# Altium project PCB_Project1.PrjPCB
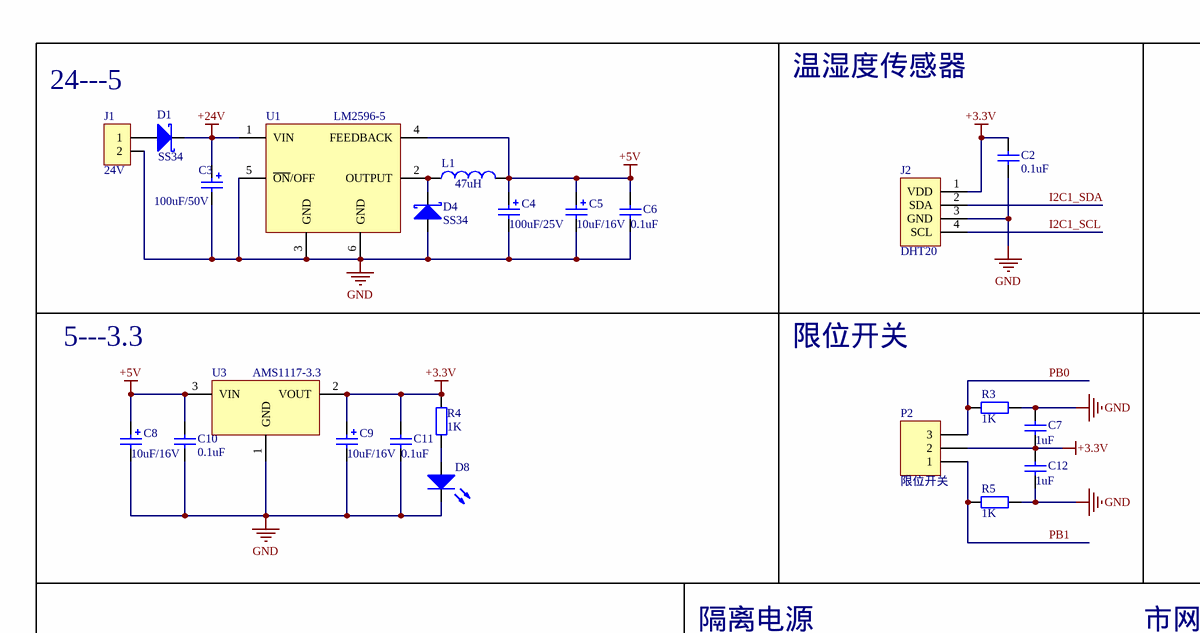
[diagram p0: Sheet1.SchDoc, top left]
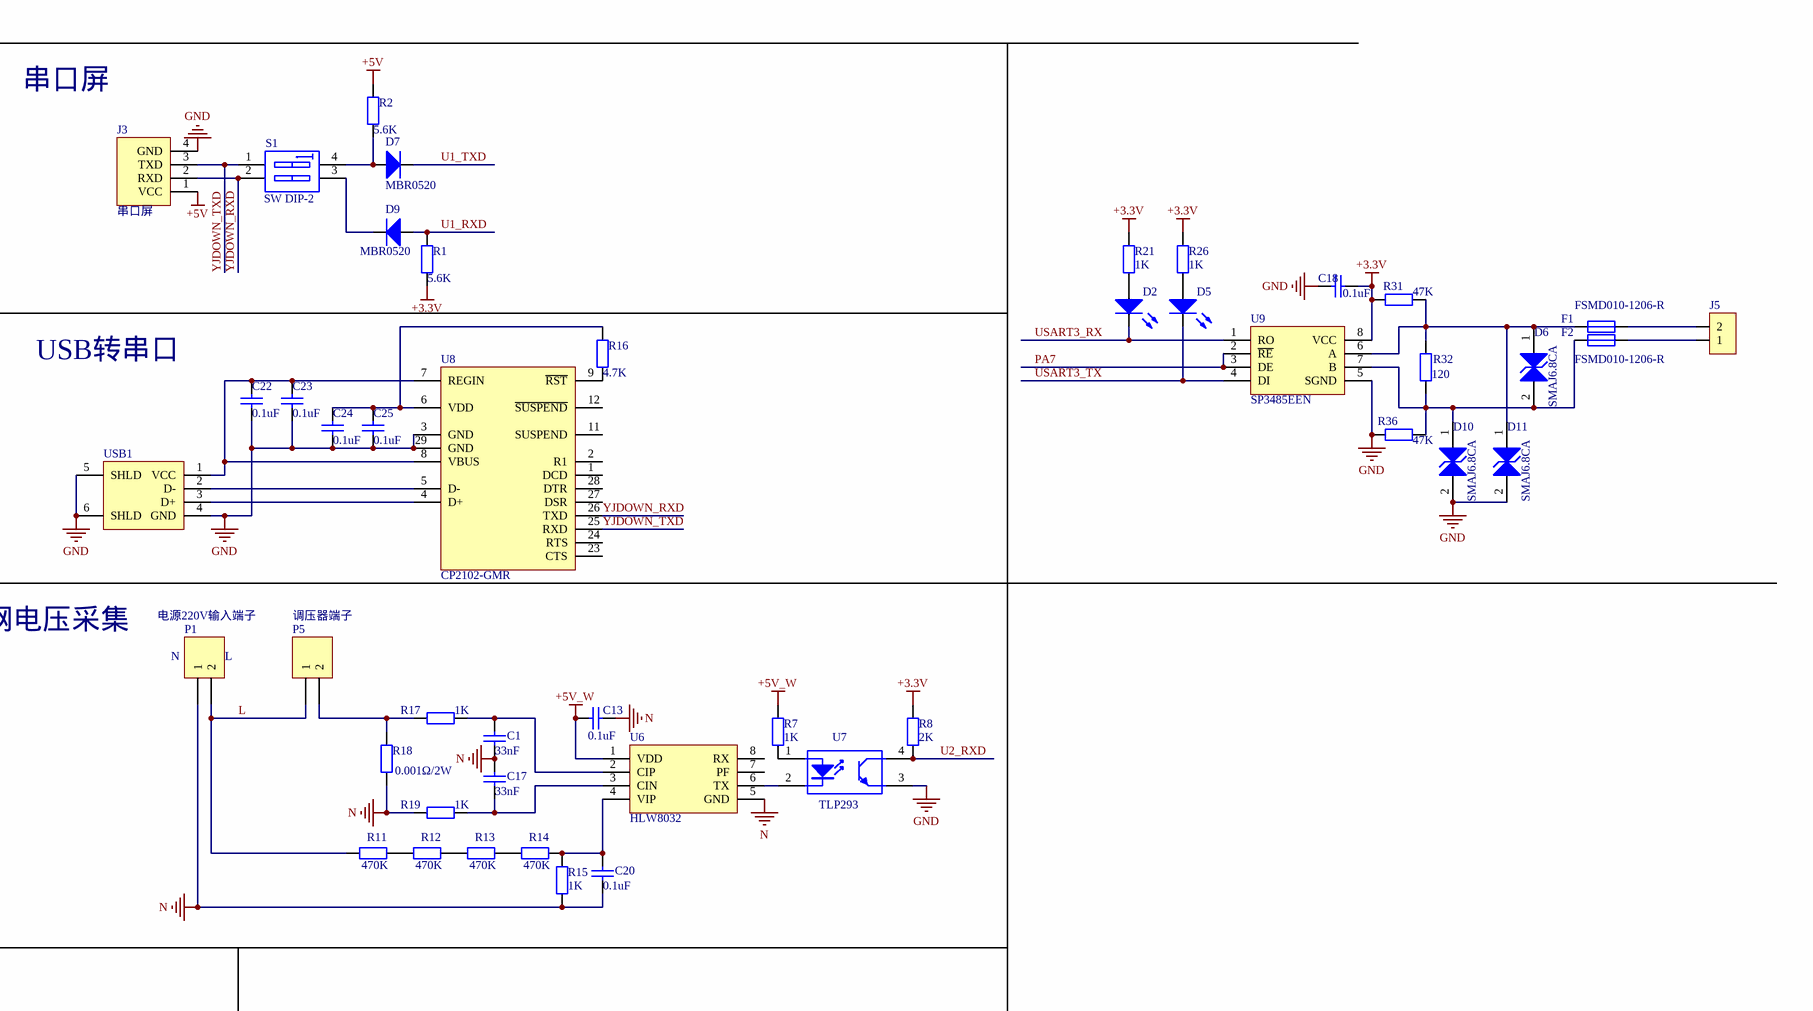
[diagram p1: Sheet1.SchDoc, top right]
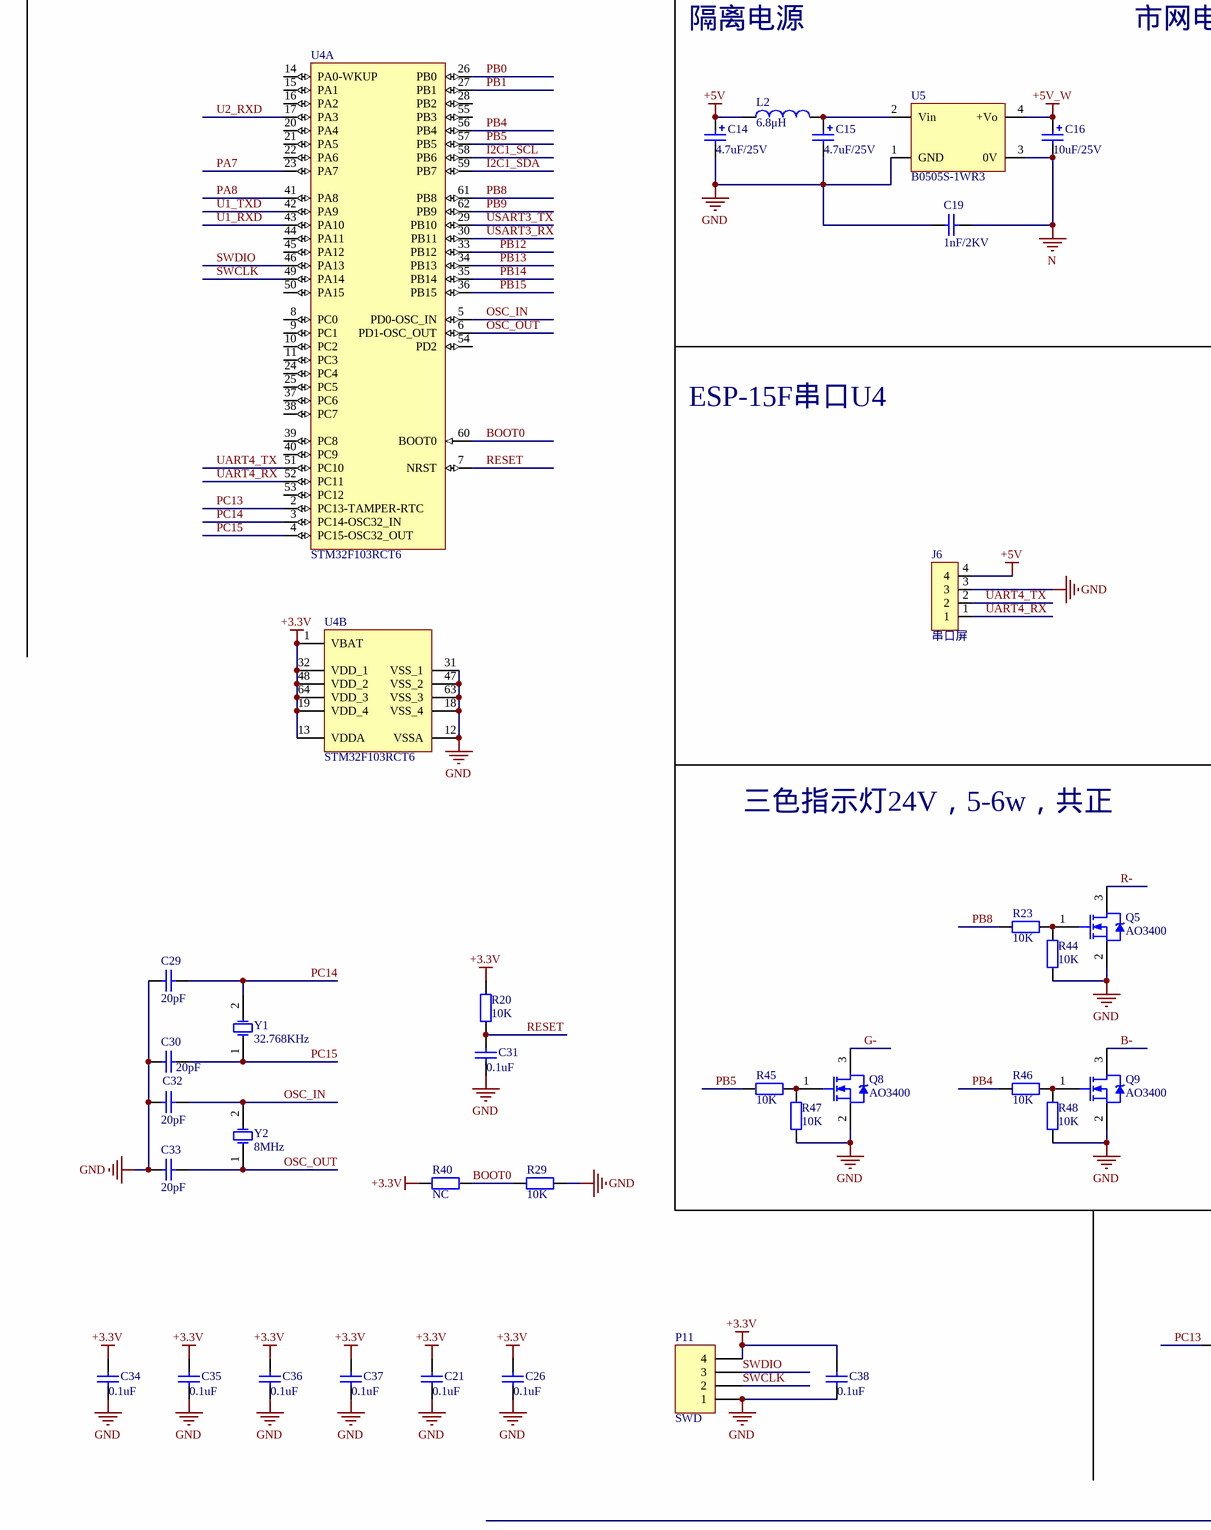
[diagram p2: Sheet1.SchDoc, bottom left]
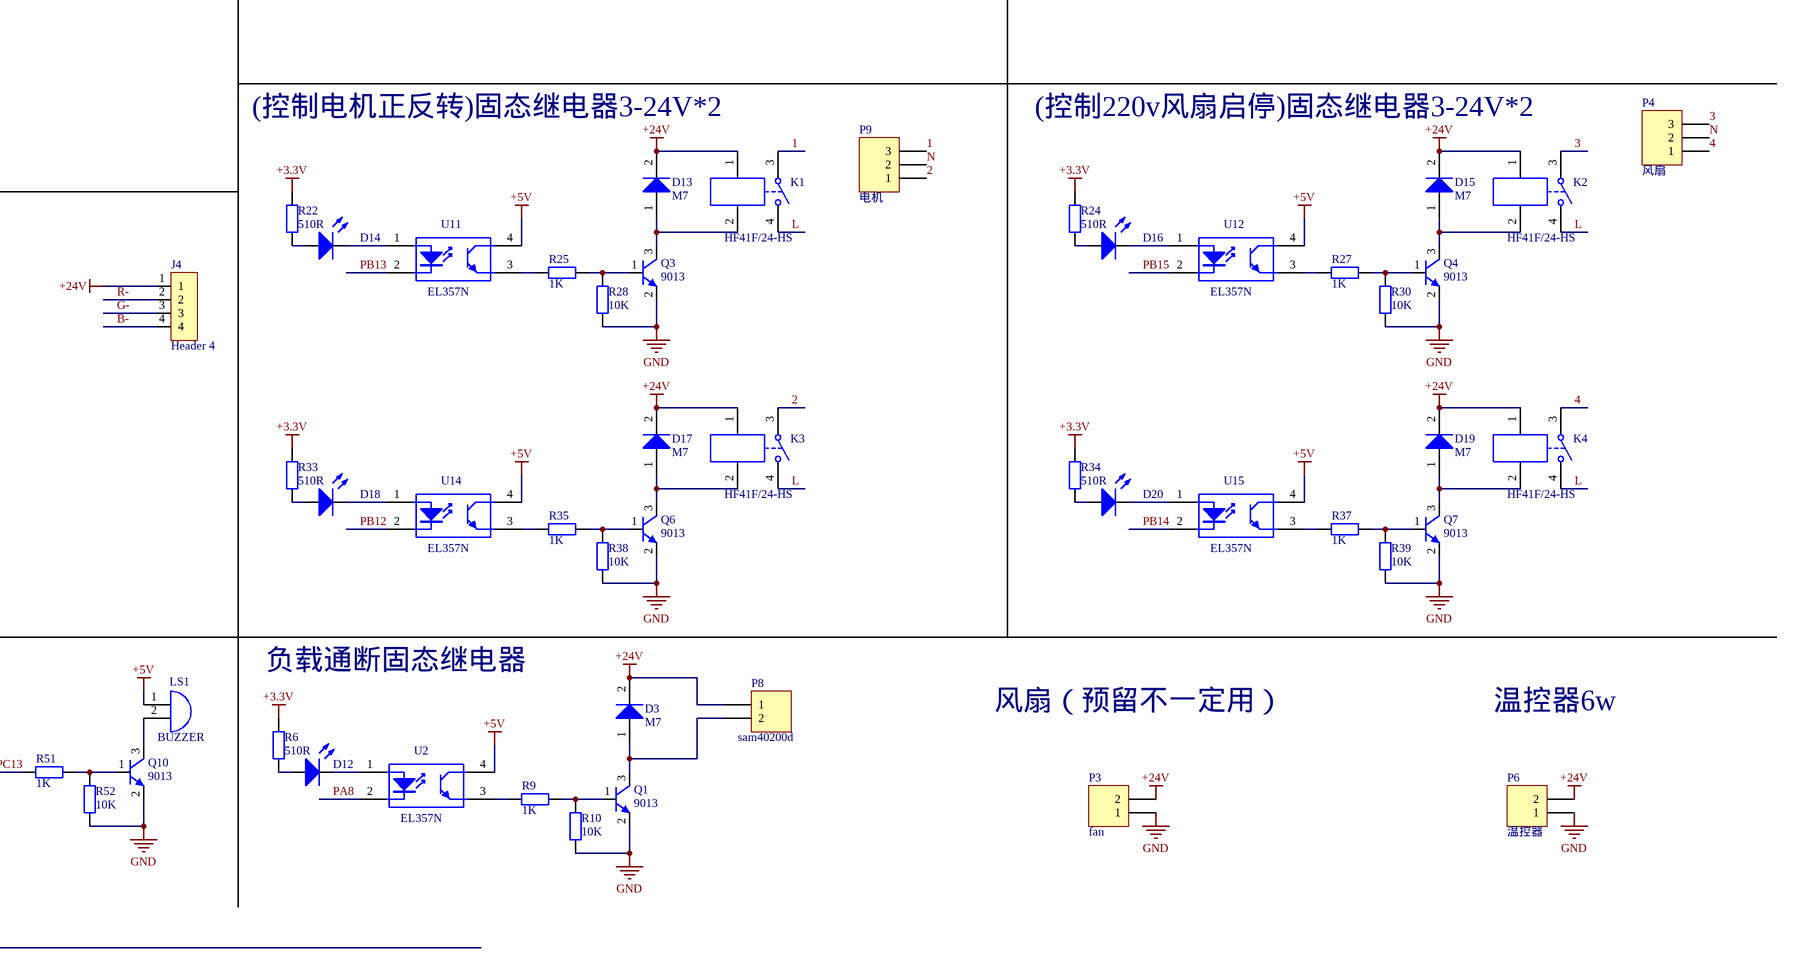
[diagram p3: Sheet1.SchDoc, bottom right]
1 sheet, 153 parts. Net scope: global (net labels, ports and power ports of the same name join across sheets).
Board file: PCB1.PcbDoc

## Sheet Sheet1.SchDoc
size A2; SheetNumber: 0; SheetTotal: 0

### Parts
C1  33nF  [1206_C]
C2  0.1uF  [0603_C]
C3  100uF/50V  [CM F(8*10.2)]
C4  100uF/25V  [CM D8(6.3*7.7)]
C5  10uF/16V  [CASE-A_3216]
C6  0.1uF  [0603_C]
C7  1uF  [0603_C]
C8  10uF/16V  [CASE-A_3216]
C9  10uF/16V  [CASE-A_3216]
C10  0.1uF  [0603_C]
C11  0.1uF  [0603_C]
C12  1uF  [0603_C]
C13  0.1uF  [0603_C]
C14  4.7uF/25V  [CASE-A_3216]
C15  4.7uF/25V  [CASE-A_3216]
C16  10uF/25V  [CASE-A_3216]
C17  33nF  [1206_C]
C18  0.1uF  [0603_C]
C19  1nF/2KV  [MLCC5.08-A]
C20  0.1uF  [1206_C]
C21  0.1uF  [0603_C]
C22  0.1uF  [0603_C]
C23  0.1uF  [0603_C]
C24  0.1uF  [0603_C]
C25  0.1uF  [0603_C]
C26  0.1uF  [0603_C]
C29  20pF  [0603_C]
C30  20pF  [0603_C]
C31  0.1uF  [0603_C]
C32  20pF  [0603_C]
C33  20pF  [0603_C]
C34  0.1uF  [0603_C]
C35  0.1uF  [0603_C]
C36  0.1uF  [0603_C]
C37  0.1uF  [0603_C]
C38  0.1uF  [0603_C]
D1  SS34  [SMA(DO-214AC)]
D2  LED  [LED 0603R]  (value not drawn)
D3  M7  [SMA(DO-214AC)]
D4  SS34  [SMA(DO-214AC)]
D5  LED  [LED 0603R]  (value not drawn)
D6  SMAJ6.8CA  [SMA-BIB]
D7  MBR0520  [SOD-123]
D8  LED  [LED 0603R]  (value not drawn)
D9  MBR0520  [SOD-123]
D10  SMAJ6.8CA  [SMA-BIB]
D11  SMAJ6.8CA  [SMA-BIB]
D12  LED  [LED 0603R]  (value not drawn)
D13  M7  [SMA(DO-214AC)]
D14  LED  [LED 0603R]  (value not drawn)
D15  M7  [SMA(DO-214AC)]
D16  LED  [LED 0603R]  (value not drawn)
D17  M7  [SMA(DO-214AC)]
D18  LED  [LED 0603R]  (value not drawn)
D19  M7  [SMA(DO-214AC)]
D20  LED  [LED 0603R]  (value not drawn)
F1  FSMD010-1206-R  [1206_L]
F2  FSMD010-1206-R  [1206_L]
J1  24V  [KF2EDGK5.08-LI-2P]
J2  DHT20  [HDR2.54-LI-4P]
J3  串口屏  [XH2.54-LI-4P]
J4  Header 4  [XH2.54-LI-4P]
J5  (no value)  [XH2.54-LI-2P]
J6  串口屏  [XH2.54-LI-4P]
K1  HF41F/24-HS  [RELAY-TH_HF41F-XX-HS]
K2  HF41F/24-HS  [RELAY-TH_HF41F-XX-HS]
K3  HF41F/24-HS  [RELAY-TH_HF41F-XX-HS]
K4  HF41F/24-HS  [RELAY-TH_HF41F-XX-HS]
L1  47uH  [CDRH127]
L2  6.8μH  [IND-SMD_L4.4-W4.2]
LS1  BUZZER  [BEEP 7.6x12x9.5]
P1  电源220V输入端子  [CONN-TH_KF8500-8.5-2P]
P2  限位开关  [XH2.54-LI-3P]
P3  fan  [XH2.54-LI-2P]
P4  风扇  [CONN-TH_KF8500-8.5-3P]
P5  调压器端子  [CONN-TH_KF8500-8.5-2P]
P6  温控器  [XH2.54-LI-2P]
P8  sam40200d  [XH2.54-LI-2P]
P9  电机  [CONN-TH_KF8500-8.5-3P]
P11  SWD  [HDR2.54-LI-4P]
Q1  9013  [SOT-23(SOT-23-3)]
Q3  9013  [SOT-23(SOT-23-3)]
Q4  9013  [SOT-23(SOT-23-3)]
Q5  AO3400  [SOT-23(SOT-23-3)]
Q6  9013  [SOT-23(SOT-23-3)]
Q7  9013  [SOT-23(SOT-23-3)]
Q8  AO3400  [SOT-23(SOT-23-3)]
Q9  AO3400  [SOT-23(SOT-23-3)]
Q10  9013  [SOT-23(SOT-23-3)]
R1  5.6K  [0603_R]
R2  5.6K  [0603_R]
R3  1K  [0603_R]
R4  1K  [0603_R]
R5  1K  [0603_R]
R6  510R  [0603_R]
R7  1K  [0603_R]
R8  2K  [0603_R]
R9  1K  [0603_R]
R10  10K  [0603_R]
R11  470K  [1206_R]
R12  470K  [1206_R]
R13  470K  [1206_R]
R14  470K  [1206_R]
R15  1K  [1206_R]
R16  4.7K  [0603_R]
R17  1K  [1206_R]
R18  0.001Ω/2W  [2512_R]
R19  1K  [1206_R]
R20  10K  [0603_R]
R21  1K  [0603_R]
R22  510R  [0603_R]
R23  10K  [0603_R]
R24  510R  [0603_R]
R25  1K  [0603_R]
R26  1K  [0603_R]
R27  1K  [0603_R]
R28  10K  [0603_R]
R29  10K  [0603_R]
R30  10K  [0603_R]
R31  47K  [0603_R]
R32  120  [0603_R]
R33  510R  [0603_R]
R34  510R  [0603_R]
R35  1K  [0603_R]
R36  47K  [0603_R]
R37  1K  [0603_R]
R38  10K  [0603_R]
R39  10K  [0603_R]
R40  NC  [0603_R]
R44  10K  [0603_R]
R45  10K  [0603_R]
R46  10K  [0603_R]
R47  10K  [0603_R]
R48  10K  [0603_R]
R51  1K  [0603_R]
R52  10K  [0603_R]
S1  SW DIP-2  [CSW DIP-2P]
U1  LM2596-5  [TO-263-5]
U2  EL357N  [SMD-4]
U3  AMS1117-3.3  [SOT-223]
U4  STM32F103RCT6  [LQFP64 10x10_N]  (parts A,B of 2)
U5  B0505S-1WR3  [PWRM-TH_B0503S-1WR2]
U6  HLW8032  [SOP-8_150mil]
U7  TLP293  [SMD-4]
U8  CP2102-GMR  [QFN-28_5x5x05P]
U9  SP3485EEN  [SOIC-8_150mil]
U11  EL357N  [SMD-4]
U12  EL357N  [SMD-4]
U14  EL357N  [SMD-4]
U15  EL357N  [SMD-4]
USB1  (no value)  [USB2.0-A]
Y1  32.768KHz  [OSC-3x8-LI]
Y2  8MHz  [OSC HC-49S]

### Nets
+3.3V: C2.2 C7.1 C9.1 C11.2 C12.2 C18.1 C21.2 C26.2 C34.2 C35.2 C36.2 C37.2 C38.2 J2.1(VDD) P2.2 P11.4 R1.2 R4.2 R6.1 R8.2 R20.2 R21.2 R22.1 R24.1 R26.2 R31.2 R33.1 R34.1 R40.2 U3.2(VOUT) U4.1(VBAT) U4.13(VDDA) U4.19(VDD_4) U4.32(VDD_1) U4.48(VDD_2) U4.64(VDD_3) U9.8(VCC)
+5V: C4.1 C5.1 C6.2 C8.1 C10.2 C14.1 J3.1(VCC) J6.4 L1.2 L2.1 LS1.1 R2.1 U1.4(FEEDBACK) U2.4 U3.3(VIN) U11.4 U12.4 U14.4 U15.4
+5V_W: C13.2 C16.1 R7.2 U5.4(+Vo) U6.1(VDD)
+24V: C3.1 D1.2 D3.2(K) D13.2(K) D15.2(K) D17.2(K) D19.2(K) J4.1 K1.1 K2.1 K3.1 K4.1 P3.2 P6.2 P8.1 U1.1(VIN)
GND: C2.1 C3.2 C4.2 C5.2 C6.1 C7.2 C8.2 C9.2 C10.1 C11.1 C12.1 C14.2 C15.2 C18.2 C19.1 C21.1 C22.1 C23.1 C24.1 C25.1 C26.1 C29.2 C30.2 C31.1 C32.2 C33.2 C34.1 C35.1 C36.1 C37.1 C38.1 D4.1 D8.2 D10.2(K) D11.2(K) J1.2 J2.3(GND) J3.4(GND) J6.3 P3.1 P6.1 P11.1 Q1.2 Q3.2 Q4.2 Q5.2(S) Q6.2 Q7.2 Q8.2(S) Q9.2(S) Q10.2 R3.1 R5.1 R10.1 R28.1 R29.2 R30.1 R36.2 R38.1 R39.1 R44.1 R47.1 R48.1 R52.1 U1.3(GND) U1.5(~{ON}/OFF) U1.6(GND) U3.1(GND) U4.12(VSSA) U4.18(VSS_4) U4.31(VSS_1) U4.47(VSS_2) U4.63(VSS_3) U5.1(GND) U7.3 U8.3(GND) U8.29(GND) U9.5(SGND) USB1.4(GND) USB1.5(SHLD) USB1.6(SHLD)
N: C1.1 C13.1 C16.2 C17.2 C19.2 C20.1 P1.1 P4.2 P9.2 R15.2 R18.2 R19.2 U5.3(0V) U6.5(GND)
1: K1.3 P9.3
2: K3.3 P9.1
3: K2.3 P4.3
4: K4.3 P4.1
B-: J4.4 Q9.3(D)
BOOT0: R29.1 R40.1 U4.60(BOOT0)
G-: J4.3 Q8.3(D)
I2C1_SCL: J2.4(SCL) U4.58(PB6)
I2C1_SDA: J2.2(SDA) U4.59(PB7)
L: K1.4 K2.4 K3.4 K4.4 P1.2 P5.1 R11.2
OSC_IN: C32.1 U4.5(PD0-OSC_IN) Y2.2(OSC2)
OSC_OUT: C33.1 U4.6(PD1-OSC_OUT) Y2.1(OSC1)
PA7: U4.23(PA7) U9.2(~{RE}) U9.3(DE)
PA8: U2.2 U4.41(PA8)
PB0: P2.3 R3.2 U4.26(PB0)
PB1: P2.1 R5.2 U4.27(PB1)
PB4: R46.2 U4.56(PB4)
PB5: R45.2 U4.57(PB5)
PB8: R23.2 U4.61(PB8)
PB9: U4.62(PB9)
PB12: U4.33(PB12) U14.2
PB13: U4.34(PB13) U11.2
PB14: U4.35(PB14) U15.2
PB15: U4.36(PB15) U12.2
PC13: R51.2 U4.2(PC13-TAMPER-RTC)
PC14: C29.1 U4.3(PC14-OSC32_IN) Y1.2(OSC2)
PC15: C30.1 U4.4(PC15-OSC32_OUT) Y1.1(OSC1)
R-: J4.2 Q5.3(D)
RESET: C31.2 R20.1 U4.7(NRST)
SWCLK: P11.2 U4.49(PA14)
SWDIO: P11.3 U4.46(PA13)
U1_RXD: D9.1(A) R1.1 U4.43(PA10)
U1_TXD: D7.2(K) U4.42(PA9)
U2_RXD: R8.1 U4.17(PA3) U7.4
UART4_RX: J6.1 U4.52(PC11)
UART4_TX: J6.2 U4.51(PC10)
USART3_RX: D2.2 U4.30(PB11) U9.1(RO)
USART3_TX: D5.2 U4.29(PB10) U9.4(DI)
YJDOWN_RXD: J3.2(RXD) S1.2(A2) U8.26(TXD)
YJDOWN_TXD: J3.3(TXD) S1.1(A1) U8.25(RXD)
NetC1_2: C1.2 R17.1 U6.2(CIP)
NetC15_1: C15.1 L2.2 U5.2(Vin)
NetC17_1: C17.1 R19.1 U6.3(CIN)
NetC20_2: C20.2 R14.1 R15.1 U6.4(VIP)
NetC22_2: C22.2 C23.2 U8.7(REGIN) U8.8(VBUS) USB1.1(VCC)
NetC24_2: C24.2 C25.2 R16.2 U8.6(VDD)
NetD1_1: D1.1 J1.1
NetD2_1: D2.1 R21.1
NetD3_1: D3.1(A) P8.2 Q1.3
NetD4_2: D4.2 L1.1 U1.2(OUTPUT)
NetD5_1: D5.1 R26.1
NetD6_1: D6.1(A) D11.1(A) F1.1 R31.1 R32.2 U9.6(A)
NetD6_2: D6.2(K) D10.1(A) F2.1 R32.1 R36.1 U9.7(B)
NetD7_1: D7.1(A) R2.2 S1.4(B1)
NetD8_1: D8.1 R4.1
NetD9_2: D9.2(K) S1.3(B2)
NetD12_1: D12.1 R6.2
NetD12_2: D12.2 U2.1
NetD13_1: D13.1(A) K1.2 Q3.3
NetD14_1: D14.1 R22.2
NetD14_2: D14.2 U11.1
NetD15_1: D15.1(A) K2.2 Q4.3
NetD16_1: D16.1 R24.2
NetD16_2: D16.2 U12.1
NetD17_1: D17.1(A) K3.2 Q6.3
NetD18_1: D18.1 R33.2
NetD18_2: D18.2 U14.1
NetD19_1: D19.1(A) K4.2 Q7.3
NetD20_1: D20.1 R34.2
NetD20_2: D20.2 U15.1
NetF1_2: F1.2 J5.2
NetF2_2: F2.2 J5.1
NetLS1_2: LS1.2 Q10.3
NetP5_2: P5.2 R17.2 R18.1
NetQ1_1: Q1.1 R9.1 R10.2
NetQ3_1: Q3.1 R25.1 R28.2
NetQ4_1: Q4.1 R27.1 R30.2
NetQ5_1: Q5.1(G) R23.1 R44.2
NetQ6_1: Q6.1 R35.1 R38.2
NetQ7_1: Q7.1 R37.1 R39.2
NetQ8_1: Q8.1(G) R45.1 R47.2
NetQ9_1: Q9.1(G) R46.1 R48.2
NetQ10_1: Q10.1 R51.1 R52.2
NetR7_1: R7.1 U7.1
NetR9_2: R9.2 U2.3
NetR11_1: R11.1 R12.2
NetR12_1: R12.1 R13.2
NetR13_1: R13.1 R14.2
NetR16_1: R16.1 U8.9(~{RST})
NetR25_2: R25.2 U11.3
NetR27_2: R27.2 U12.3
NetR35_2: R35.2 U14.3
NetR37_2: R37.2 U15.3
NetU6_6: U6.6(TX) U7.2
NetU8_4: U8.4(D+) USB1.3(D+)
NetU8_5: U8.5(D-) USB1.2(D-)

Not connected (* = marked no-connect by the designer): U4 8(PC0) 9(PC1) 10(PC2) 11(PC3) 14(PA0-WKUP) 15(PA1) 16(PA2) 20(PA4) 21(PA5) 22(PA6) 24(PC4) 25(PC5) 28(PB2) 37(PC6) 38(PC7) 39(PC8) 40(PC9) 44(PA11) 45(PA12) 50(PA15) 53(PC12) 54(PD2) 55(PB3); U6 7(PF) 8(RX); U8 1(DCD) 2(R1) 11(SUSPEND) 12(~{SUSPEND}) 23(CTS) 24(RTS) 27(DSR) 28(DTR)

### Notes on the sheet
- 24---5
- 温湿度传感器
- 串口屏
- 5---3.3
- 限位开关
- USB转串口
- 隔离电源
- 市网电压采集
- (near P1) N
- (near P1) L
- ESP-15F串口U4
- (控制电机正反转)固态继电器3-24V*2
- (控制220v风扇启停)固态继电器3-24V*2
- 三色指示灯24V，5-6w，共正
- 负载通断固态继电器
- 风扇（预留不一定用）
- 温控器6w

### Library data of the parts
C1 C2 C6 C7 C10-C13 C17-C26 C29-C38 = Cap: J  Capacitor 无极性电容
C3-C5 C8 C9 C14-C16 = Cap Pol: J  Polarized Capacitor 有极性电容; Published: 8-Jun-2000; LatestRevisionDate: 17-Jul-2002; LatestRevisionNote: Re-released for DXP Platform.; PackageReference: RB7.6-15; Publisher: Altium Limited
D1 D4 = D Schottky: J  Schottky Diode  肖特基二极管; Published: 8-Jun-2000; LatestRevisionDate: 17-Jul-2002; LatestRevisionNote: Re-released for DXP Platform.; PackageReference: SMB; Publisher: Altium Limited; Code_JEDEC: DO-214-AA
D2 D5 D8 D12 D14 D16 D18 D20 = LED: J  LED发光二极管; Published: 8-Jun-2000; LatestRevisionDate: 08-Jul-2005; LatestRevisionNote: Mech Layer 1 removed.; PackageReference: LED-0; Publisher: Altium Limited
D3 D13 D15 D17 D19 = Diode: Default Diode; Published: 8-Jun-2000; LatestRevisionDate: 17-Jul-2002; LatestRevisionNote: Re-released for DXP Platform.; PackageVersion: Sep-1996; PackageReference: SMC; Publisher: Altium Limited; PackageDescription: DO-214-AB/SMC; 2 C-Bend Leads; Body 7.9 x 5.9 mm, inc. leads (LxW); Code_JEDEC: DO-214-AB
D6 D10 D11 = TVS1: J  TVS P6SMB6.8CA; ComponentLink1Description: 供应商链接; ComponentLink1URL: http://www.szlcsc.com/product/details_79530.html; Package: SMB/DO-214AA; Supplier: LC; SuppliersPartNumber: C78395
D7 D9 = Diode: J  Default Diode 普通二极管; Published: 8-Jun-2000; LatestRevisionDate: 17-Jul-2002; LatestRevisionNote: Re-released for DXP Platform.; PackageVersion: Sep-1996; PackageReference: SMC; Publisher: Altium Limited; Code_JEDEC: DO-214-AB
F1 F2 = Fuse 1: J  Fuse 保险丝; Published: 8-Jun-2000; LatestRevisionDate: 17-Jul-2002; LatestRevisionNote: Re-released for DXP Platform.; PackageReference: PIN-W2/E2.8; Publisher: Altium Limited
J1 J5 = Header 2: J  Header, 2-Pin; LatestRevisionDate: 17-Jul-2002; LatestRevisionNote: Re-released for DXP Platform.; Publisher: Altium Limited
J3 = 串口模块2: J  串口模块
J4 J6 = Header 4: J  Header, 4-Pin; LatestRevisionDate: 17-Jul-2002; LatestRevisionNote: Re-released for DXP Platform.; Publisher: Altium Limited
K1-K4 = Relay-SPST: J  Single-Pole Single-Throw Relay; Published: 24-Mar-1999; LatestRevisionDate: 17-Jul-2002; LatestRevisionNote: Re-released for DXP Platform.; PackageReference: MODULE4; Publisher: Altium Limited
L1 L2 = Inductor: J  Inductor 电感; Code_IEC: 1005; Value: 10mH; Published: 8-Jun-2000; LatestRevisionDate: 17-Jul-2002; LatestRevisionNote: Re-released for DXP Platform.; PackageReference: 0402-A; Publisher: Altium Limited; Code_JEITA: 0402
LS1 = Bell: J  Electrical Bell 蜂鸣器
P1 P3 P5 P6 P8 = Header 2: Header, 2-Pin; LatestRevisionDate: 17-Jul-2002; LatestRevisionNote: Re-released for DXP Platform.; Publisher: Altium Limited
P2 P4 P9 = Header 3: Header, 3-Pin; LatestRevisionDate: 17-Jul-2002; LatestRevisionNote: Re-released for DXP Platform.; Publisher: Altium Limited
P11 = Header 4: Header, 4-Pin; LatestRevisionDate: 17-Jul-2002; LatestRevisionNote: Re-released for DXP Platform.; Publisher: Altium Limited
Q1 Q3 Q4 Q6 Q7 Q10 = NPN-1: J  NPN Bipolar Transistor  贴片三极管; Published: 8-Jun-2000; LatestRevisionDate: 17-Jul-2002; LatestRevisionNote: Re-released for DXP Platform.; PackageReference: TO-226; Publisher: Altium Limited; Code_JEDEC: TO-226-AA
Q5 Q8 Q9 = NMOS-2: N-Channel Power MOSFET; Note: Pin 2 is electrically connected to pin 4.; Published: 8-Jun-2000; LatestRevisionDate: 17-Jul-2002; LatestRevisionNote: Re-released for DXP Platform.; DatasheetVersion: PD-9.814; PackageVersion: Feb-1997; PackageReference: TO-220AB; Publisher: Altium Limited; PackageDescription: TO, Thru-Hole, Vertical, Heatsink Mounted; 3 In-Line Leads; Pitch 2.54 mm; ComponentLink1Description: Manufacturer Link; ComponentLink1URL: http://www.irf.com/
R1-R40 R44-R48 R51 R52 = Res: J  Resistor 电阻; Published: 8-Jun-2000; LatestRevisionDate: 17-Jul-2002; LatestRevisionNote: Re-released for DXP Platform.; PackageReference: AXIAL-0.4; Publisher: Altium Limited
S1 = SW DIP-2: DIP Switch, 2 Position, SPST; Published: 24-Mar-1999; LatestRevisionDate: 17-Jul-2002; LatestRevisionNote: Re-released for DXP Platform.; PackageReference: DIP-4; Publisher: Altium Limited
U1 = LM2596: J  LM2596
U2 U7 U11 U12 U14 U15 = TLP521-1: TLP521-1 光耦; Published: 24-Mar-1999; LatestRevisionDate: 17-Jul-2002; LatestRevisionNote: Re-released for DXP Platform.; PackageReference: SPST-2; Publisher: Altium Limited
U3 = AMS1117-3.3: J  AMS1117-3.3  电源芯片; JJW_SCH: JJW_SCH
U4 = STM32F103RCT6: ARM Cortex-M3 32-bit MCU, 256 KB Flash, 48 KB Internal RAM, 51 I/Os, 64-pin LQFP, -40 to 85 degC, Tray; A/D Converter: 3x12-bit (16 Channel); D/A Converter: 2x12-bit (2 Channel); FLASH Size (Prog) (kB): 256; I/Os (High Current): 51; Internal RAM Size (kB): 48; Operating Frequency(F) (Processor speed) (MHz): 72; Supply Voltage(Vcc) min (V): 2; DatasheetVersion: Rev. 8; PackageVersion: Rev. 4, 06/2013; PackageReference: LQFP64; PackageDescription: 64-Pin Low Profile Quad Flat Package, 10 x 10 mm Body, 0.5 mm Pitch; Supplier 1: Digi-Key; Supplier Part Number 1: 497-9033-ND; Supplier 2: Newark; Supplier Part Number 2: 01P4099; Supplier 3: Newark; Supplier Part Number 3: 57P1227; Supplier 4: Mouser; Supplier Part Number 4: 511-STM32F103RCT6; Core: ARM Cortex-M3; Packing: Tray; Mounting Technology: Surface Mount; PartNumber: STM32F103RCT6; ComponentLink1Description: Manufacturer URL; ComponentLink1URL: http://www.st.com/web/en/home.html; ComponentLink2Description: Datasheet; ComponentLink2URL: http://www.st.com/st-web-ui/static/active/en/resource/technical/document/datasheet/CD00191185.pdf; ComponentLink3Description: Package Specification; ComponentLink3URL: http://www.st.com/st-web-ui/static/active/en/resource/technical/document/datasheet/DM00037051.pdf
U5 = B0505S-1WR3: DC-DC模块; 版权归属: 源创客; BOM名称: DC-DC模块; 学习资源: www.ooocke.com
U8 = CP2102-GMR: USB; ComponentLink1Description: 供应商链接; ComponentLink1URL: http://www.szlcsc.com/product/details_7033.html; Package: QFN-28_5x5x05P; Supplier: LC; SuppliersPartNumber: C6568
U9 = SP485R
USB1 = USB2: J  USB; LatestRevisionDate: 17-Jul-2002; LatestRevisionNote: Re-released for DXP Platform.; Publisher: Altium Limited
Y1 Y2 = XTAL: Crystal Oscillator; Published: 8-Jun-2000; LatestRevisionDate: 17-Jul-2002; LatestRevisionNote: Re-released for DXP Platform.; PackageReference: R38; Publisher: Altium Limited; PackageDescription: Crystal, Thru-Hole; 2 Leads; Body 3.1 x 8.2 mm (Dia.xH)